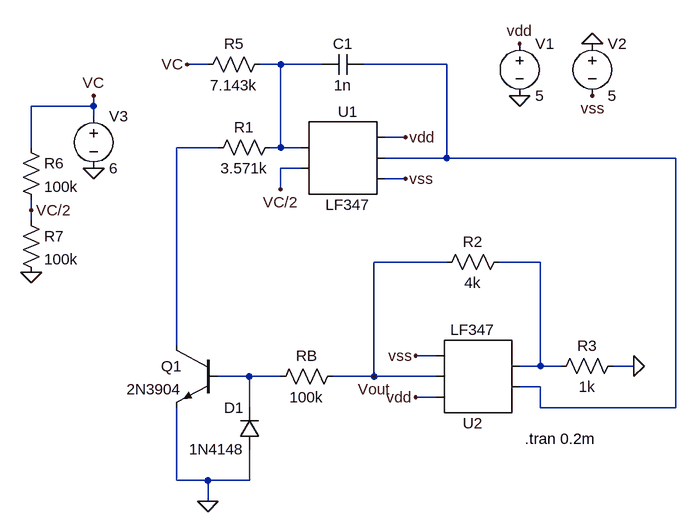
[diagram p0: schematic AnalogEx5_2.asc]
AnalogEx5_2.asc, the LTspice schematic file:
Version 4
SHEET 1 1332 680
WIRE -64 -128 -96 -128
WIRE 48 -128 16 -128
WIRE 112 -128 48 -128
WIRE 304 -128 176 -128
WIRE -240 -64 -240 -80
WIRE -240 -64 -336 -64
WIRE -240 -48 -240 -64
WIRE 240 -16 208 -16
WIRE -336 0 -336 -64
WIRE -48 0 -112 0
WIRE 48 0 48 -128
WIRE 48 0 32 0
WIRE 80 0 48 0
WIRE 304 16 304 -128
WIRE 304 16 208 16
WIRE 656 16 304 16
WIRE 80 32 48 32
WIRE 240 48 208 48
WIRE 48 64 48 32
WIRE -336 96 -336 80
WIRE -336 112 -336 96
WIRE 304 176 192 176
WIRE 448 176 384 176
WIRE -112 304 -112 0
WIRE 288 320 256 320
WIRE 448 336 448 176
WIRE 448 336 416 336
WIRE 480 336 448 336
WIRE 592 336 560 336
WIRE 0 352 -48 352
WIRE 48 352 0 352
WIRE 192 352 192 176
WIRE 192 352 128 352
WIRE 288 352 192 352
WIRE 448 368 416 368
WIRE 288 384 256 384
WIRE 0 400 0 352
WIRE 448 400 448 368
WIRE 656 400 656 16
WIRE 656 400 448 400
WIRE -112 512 -112 400
WIRE -64 512 -112 512
WIRE 0 512 0 464
WIRE 0 512 -64 512
WIRE -64 544 -64 512
FLAG 240 -16 vdd
FLAG 240 48 vss
FLAG 416 -80 0
FLAG 528 -160 0
FLAG 416 -160 vdd
FLAG 528 -80 vss
FLAG -240 32 0
FLAG -96 -128 VC
FLAG -240 -80 VC
FLAG -336 192 0
FLAG -336 96 VC/2
FLAG 48 64 VC/2
FLAG -64 544 0
FLAG 256 384 vdd
FLAG 256 320 vss
FLAG 592 336 0
FLAG 192 352 Vout
SYMBOL AutoGenerated\\LF347 144 16 R0
WINDOW 0 8 -56 Bottom 2
WINDOW 3 8 56 Top 2
SYMATTR InstName U1
SYMBOL cap 176 -144 R90
WINDOW 0 0 32 VBottom 2
WINDOW 3 32 32 VTop 2
SYMATTR InstName C1
SYMATTR Value 1n
SYMBOL res 48 -16 R90
WINDOW 0 0 56 VBottom 2
WINDOW 3 32 56 VTop 2
SYMATTR InstName R1
SYMATTR Value 3.571k
SYMBOL voltage 416 -176 R0
SYMATTR InstName V1
SYMATTR Value 5
SYMBOL voltage 528 -176 R0
SYMATTR InstName V2
SYMATTR Value 5
SYMBOL voltage -240 -64 R0
SYMATTR InstName V3
SYMATTR Value 6
SYMBOL res 32 -144 R90
WINDOW 0 0 56 VBottom 2
WINDOW 3 32 56 VTop 2
SYMATTR InstName R5
SYMATTR Value 7.143k
SYMBOL res -352 -16 R0
SYMATTR InstName R6
SYMATTR Value 100k
SYMBOL res -352 96 R0
SYMATTR InstName R7
SYMATTR Value 100k
SYMBOL diode 16 464 R180
WINDOW 0 24 64 Left 2
WINDOW 3 24 0 Left 2
SYMATTR InstName D1
SYMATTR Value 1N4148
SYMBOL npn -48 304 M0
SYMATTR InstName Q1
SYMATTR Value 2N3904
SYMBOL res 144 336 R90
WINDOW 0 0 56 VBottom 2
WINDOW 3 32 56 VTop 2
SYMATTR InstName RB
SYMATTR Value 100k
SYMBOL AutoGenerated\\LF347 352 352 R180
WINDOW 0 8 -56 Bottom 2
WINDOW 3 8 56 Top 2
SYMATTR InstName U2
SYMBOL res 576 320 R90
WINDOW 0 0 56 VBottom 2
WINDOW 3 32 56 VTop 2
SYMATTR InstName R3
SYMATTR Value 1k
SYMBOL res 400 160 R90
WINDOW 0 0 56 VBottom 2
WINDOW 3 32 56 VTop 2
SYMATTR InstName R2
SYMATTR Value 4k
TEXT 424 448 Left 2 !.tran 0.2m

The netlist it stands for:
* AnalogEx5_2.asc
* U1: LF347 (symbol AutoGenerated\LF347 not available, pins judged from their places): pin1=N001 pin2=VC/2 pin3=vdd pin4=N002 pin5=vss
C1 N002 N001 1n
R1 N001 N003 3.571k
V1 vdd 0 5
V2 0 vss 5
V3 VC 0 6
R5 N001 VC 7.143k
R6 VC VC/2 100k
R7 VC/2 0 100k
D1 0 N005 1N4148
Q1 N003 N005 0 0 2N3904
RB Vout N005 100k
* U2: LF347 (symbol AutoGenerated\LF347 not available, pins judged from their places): pin1=N002 pin2=N004 pin3=vdd pin4=Vout pin5=vss
R3 0 N004 1k
R2 N004 Vout 4k
.model D D
.lib standard.dio
.model NPN NPN
.model PNP PNP
.lib standard.bjt
.tran 0.2m
.backanno
.end